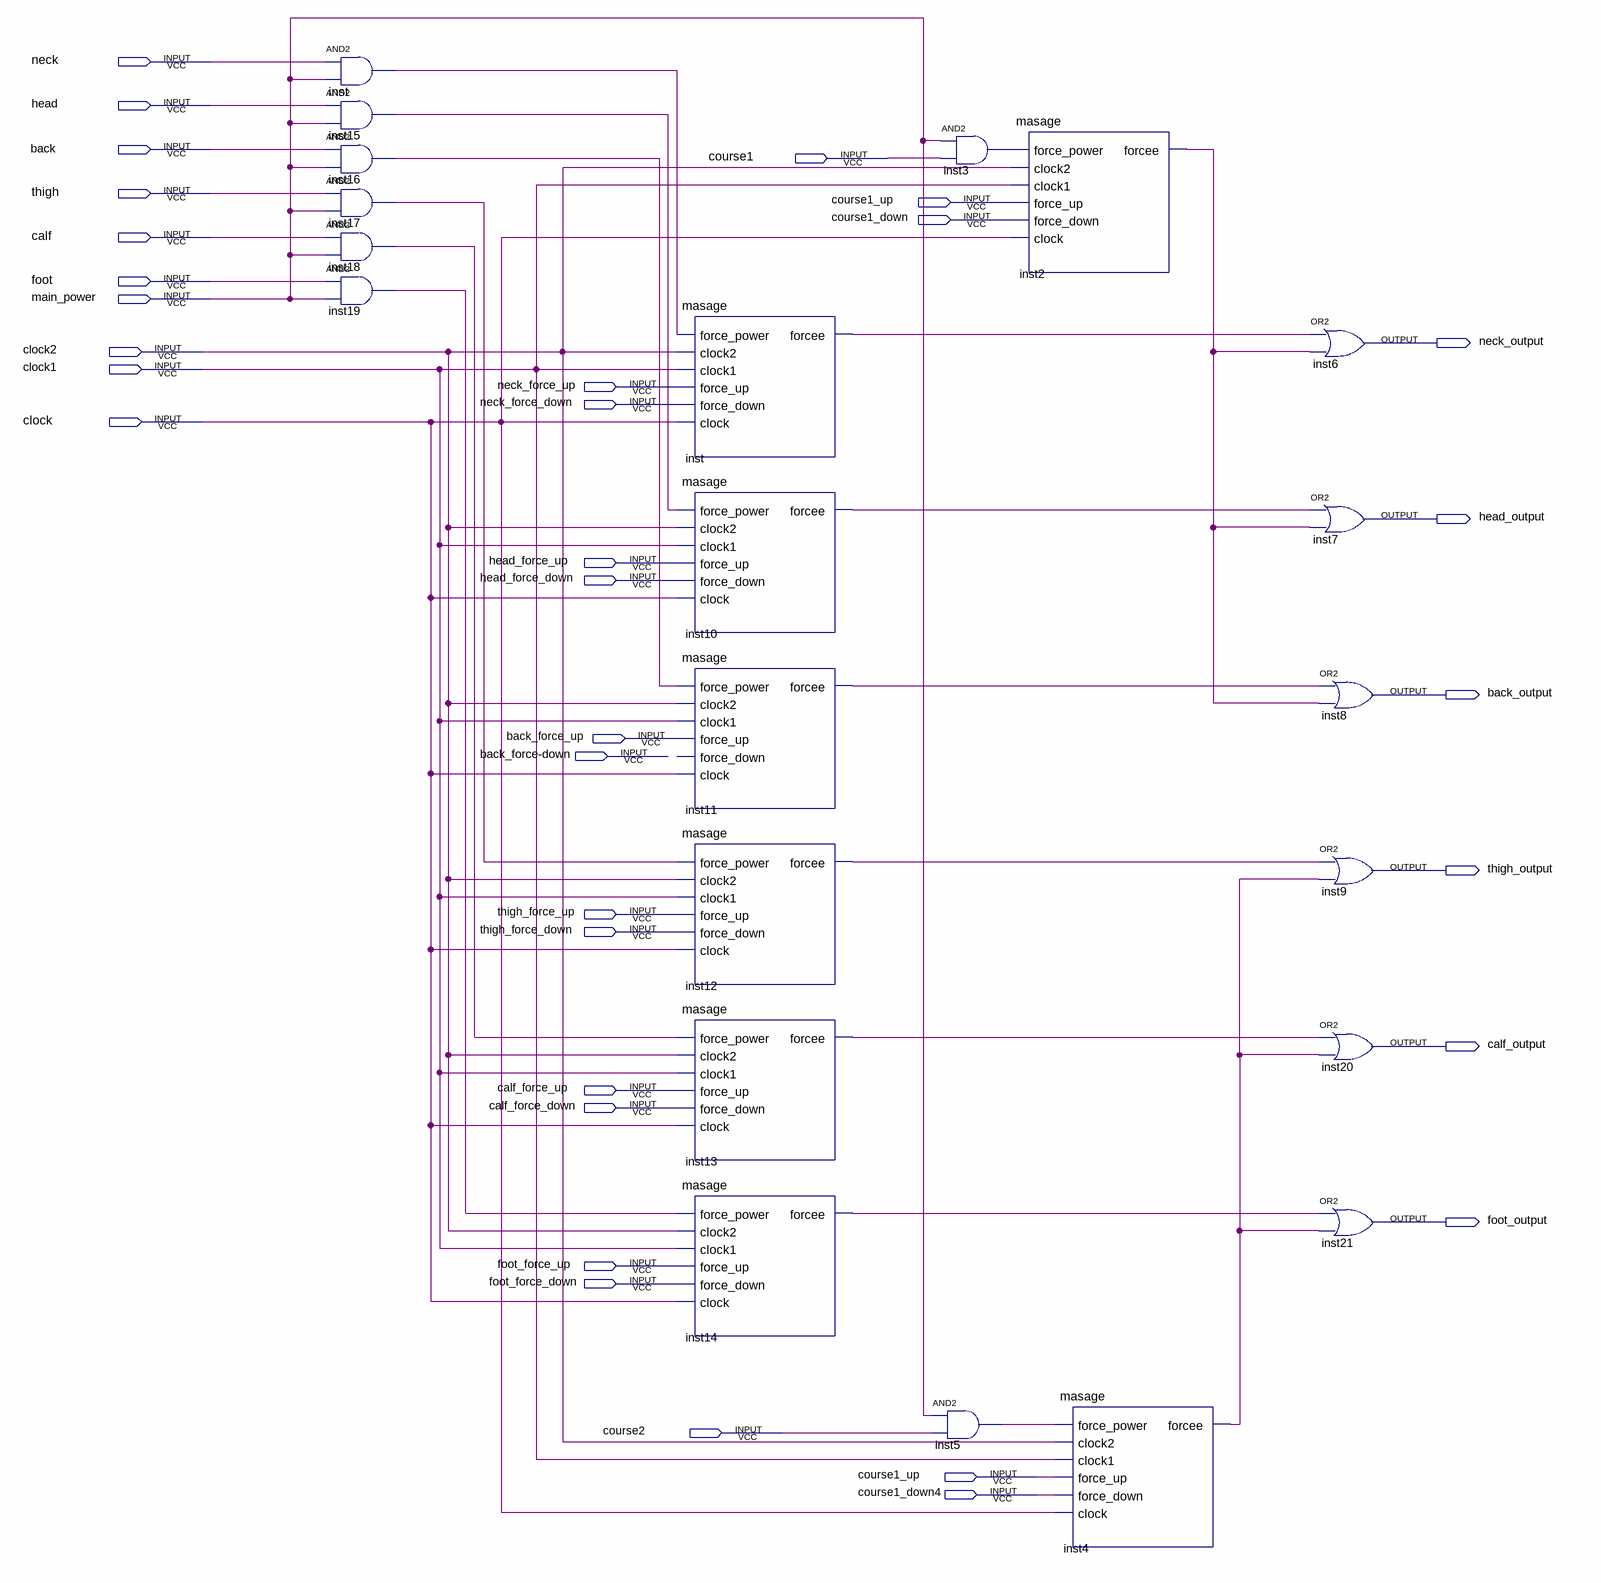
[diagram p0: schematic sheet]
// Quartus schematic gorani_remotecontrol.bdf as structural Verilog: 22 symbols, 34 pins
module gorani_remotecontrol (
  input  neck,
  input  head,
  input  back,
  input  course1,
  input  thigh,
  input  course1_up,
  input  course1_down,
  input  calf,
  input  foot,
  input  main_power,
  input  clock2,
  input  clock1,
  input  neck_force_up,
  input  neck_force_down,
  input  clock,
  input  head_force_up,
  input  head_force_down,
  input  back_force_up,
  input  \back_force-down ,
  input  thigh_force_up,
  input  thigh_force_down,
  input  calf_force_up,
  input  calf_force_down,
  input  foot_force_up,
  input  foot_force_down,
  input  course2,
  input  course1_down4,
  output neck_output,
  output head_output,
  output back_output,
  output thigh_output,
  output calf_output,
  output foot_output
);

  wire inst2_forcee, inst3_out, inst4_forcee, inst5_out, inst10_forcee, inst11_forcee, inst12_forcee,
       inst13_forcee, inst14_forcee, inst15_out, inst16_out, inst17_out, inst18_out, inst19_out, inst_forcee,
       inst_out;

  and inst (inst_out, neck, main_power);
  and inst15 (inst15_out, head, main_power);
  and inst16 (inst16_out, back, main_power);
  and inst17 (inst17_out, thigh, main_power);
  and inst18 (inst18_out, calf, main_power);
  and inst19 (inst19_out, foot, main_power);
  masage inst_dup2 (
    .force_power(inst_out), .clock2(clock2), .clock1(clock1), .force_up(neck_force_up),
    .force_down(neck_force_down), .clock(clock), .forcee(inst_forcee));
  masage inst10 (
    .force_power(inst15_out), .clock2(clock2), .clock1(clock1), .force_up(head_force_up),
    .force_down(head_force_down), .clock(clock), .forcee(inst10_forcee));
  masage inst11 (
    .force_power(inst16_out), .clock2(clock2), .clock1(clock1), .clock(clock), .forcee(inst11_forcee));  // open: force_up, force_down
  masage inst12 (
    .force_power(inst17_out), .clock2(clock2), .clock1(clock1), .force_up(thigh_force_up),
    .force_down(thigh_force_down), .clock(clock), .forcee(inst12_forcee));
  masage inst13 (
    .force_power(inst18_out), .clock2(clock2), .clock1(clock1), .force_up(calf_force_up),
    .force_down(calf_force_down), .clock(clock), .forcee(inst13_forcee));
  masage inst14 (
    .force_power(inst19_out), .clock2(clock2), .clock1(clock1), .force_up(foot_force_up),
    .force_down(foot_force_down), .clock(clock), .forcee(inst14_forcee));
  and inst3 (inst3_out, main_power, course1);
  and inst5 (inst5_out, main_power, course2);
  masage inst2 (
    .force_power(inst3_out), .clock2(clock2), .clock1(clock1), .force_up(course1_up),
    .force_down(course1_down), .clock(clock), .forcee(inst2_forcee));
  masage inst4 (
    .force_power(inst5_out), .clock2(clock2), .clock1(clock1), .force_up(course1_up),
    .force_down(course1_down4), .clock(clock), .forcee(inst4_forcee));
  or inst6 (neck_output, inst_forcee, inst2_forcee);
  or inst7 (head_output, inst10_forcee, inst2_forcee);
  or inst8 (back_output, inst11_forcee, inst2_forcee);
  or inst9 (thigh_output, inst12_forcee, inst4_forcee);
  or inst20 (calf_output, inst13_forcee, inst4_forcee);
  or inst21 (foot_output, inst14_forcee, inst4_forcee);
endmodule
